# Altium schematic sheet 2-FET Control.SchDoc
size A
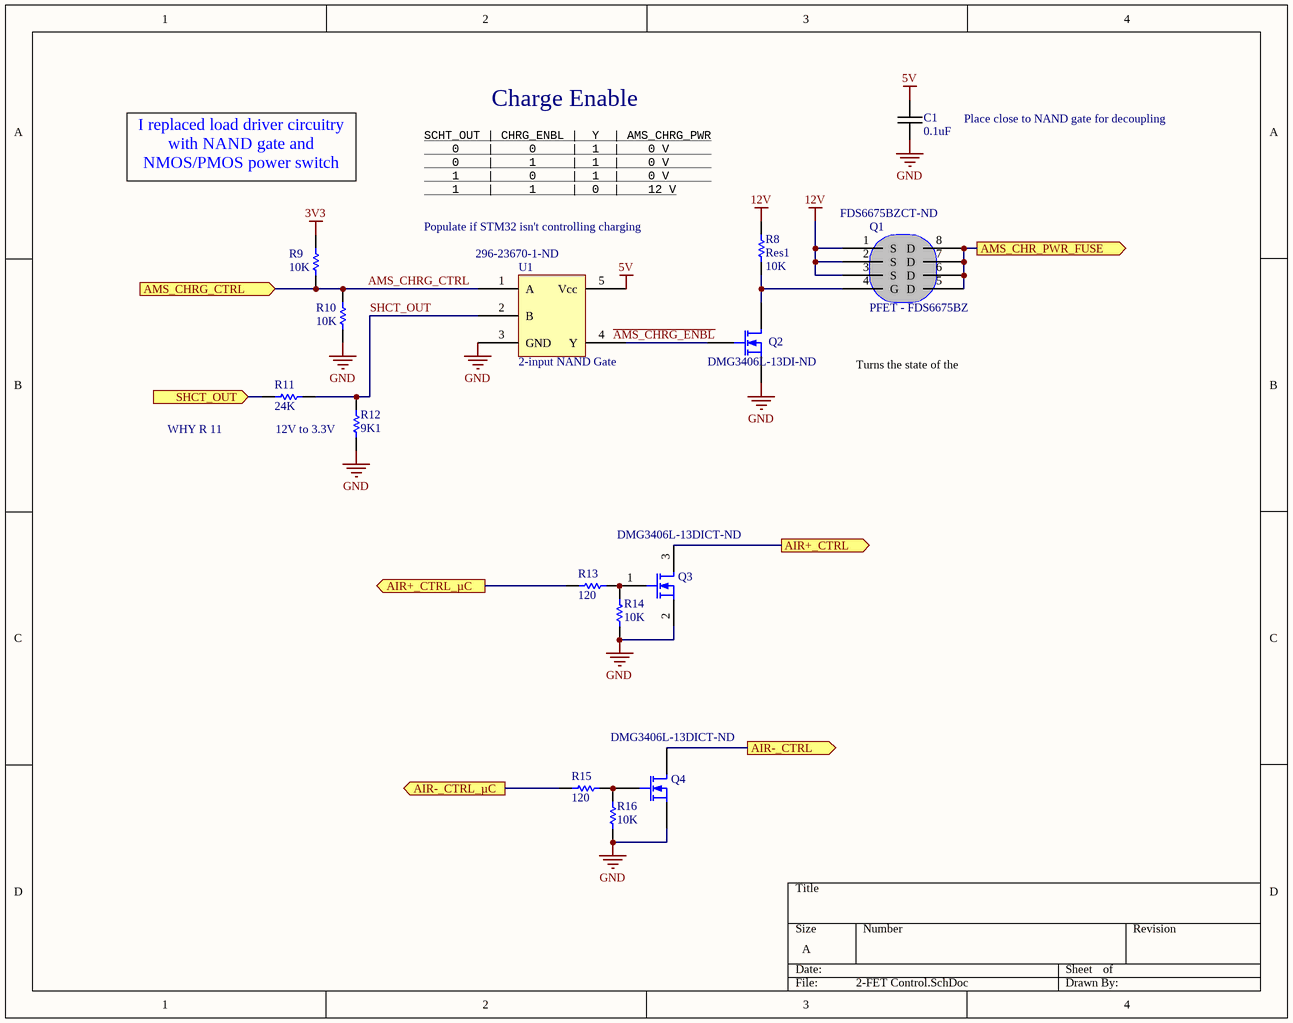
[diagram p0: 2-FET Control.SchDoc]

## Parts
C1  value 0.1uF  [1608[0603]]  (hidden comment: 100nF)
Q1  PFET - FDS6675BZ  Supplier Part Number 1: FDS6675BZCT-ND  [SOIC127P600X175-8N]
Q2  Supplier Part Number 1: DMG3406L-13DI-ND  [SOT-23_N]
Q3  Supplier Part Number 1: DMG3406L-13DICT-ND  [SOT-23_N]
Q4  Supplier Part Number 1: DMG3406L-13DICT-ND  [SOT-23_N]
R8  Res1  value 10K  [1608[0603]]
R9  10K  [RESC0603(1608)_L]
R10  10K  [RESC0603(1608)_L]
R11  24K  [RESC0603(1608)_N]
R12  9K1  [RESC0603(1608)_M]
R13  120  [1608[0603]]
R14  10K  [1608[0603]]
R15  120  [1608[0603]]
R16  10K  [1608[0603]]
U1  2-input NAND Gate  Supplier Part Number 1: 296-23670-1-ND  [SOT23-6_M]

## Ports
AIR+_CTRL (out), AIR+_CTRL_µC (out), AIR-_CTRL (out), AIR-_CTRL_µC (out), AMS_CHR_PWR_FUSE (out), AMS_CHRG_CTRL (in), SHCT_OUT (in)

## Nets
3V3: R9.2
5V: C1.1 U1.5(Vcc)
12V: Q1.1(S) Q1.2(S) Q1.3(S) R8.2
GND: C1.2 Q2.2(S) Q3.2(S) Q4.2(S) R10.1 R12.1 R14.1 R16.1 U1.3(GND)
AIR+_CTRL: Q3.3(D) ; port AIR+_CTRL
AIR+_CTRL_µC: R13.1 ; port AIR+_CTRL_µC
AIR-_CTRL: Q4.3(D) ; port AIR-_CTRL
AIR-_CTRL_µC: R15.1 ; port AIR-_CTRL_µC
AMS_CHR_PWR_FUSE: Q1.5(D) Q1.6(D) Q1.7(D) Q1.8(D) ; port AMS_CHR_PWR_FUSE
AMS_CHRG_CTRL: R9.1 R10.2 U1.1(A) ; port AMS_CHRG_CTRL
SHCT_OUT: R11.1 R12.2 U1.2(B)
SHCT_OUT: R11.2 ; port SHCT_OUT  [a separate net that carries the same name]
NetQ1_4: Q1.4(G) Q2.3(D) R8.1
NetQ2_1: Q2.1(G) U1.4(Y)
NetQ3_1: Q3.1(G) R13.2 R14.2
NetQ4_1: Q4.1(G) R15.2 R16.2

## Notes on the sheet
- Charge Enable
- Place close to NAND gate for decoupling
- I replaced load driver circuitry with NAND gate and NMOS/PMOS power switch
- (near R8) SCHT_OUT | CHRG_ENBL |  Y  | AMS_CHRG_PWR
  0    |     0     |  1  |    0 V
  0    |     1     |  1  |    0 V
  1    |     0     |  1  |    0 V
  1    |     1     |  0  |    12 V
- Populate if STM32 isn't controlling charging
- WHY R 11
- (near R12) 12V to 3.3V
- Turns the state of the
- Labels drawn without touching a wire or pin: ~{AMS_CHRG_ENBL}

## Library data of the parts
C1 = 0805C-100nF-25V-X7R-MUR: CAP CER 0.1UF 50V X7R 0603; Manufacturer: Kemet; Manufacturer Part Number: C0603C104K5RACAUTO; Capacitance: 0.1µF; Tolerance: ±10%; Supplier 1: Digi-Key; Supplier Part Number 1: 399-6856-1-ND; RoHS: RoHS Compliant; Category: Capacitors; Stock 1: 157876; Pricing 1: 1=0.14, 10=0.095, 25=0.0672, 50=0.0514, 100=0.0435, 250=0.03556, 1000=0.02324 (CAD); Packaging: Cut Tape (CT); Voltage - Rated: 50V; Temperature Coefficient: X7R; Mounting Type: Surface Mount, MLCC; Operating Temperature: -55°C ~ 125°C; Applications: Automotive; Ratings: AEC-Q200; Package / Case: 0603 (1608 Metric); Size / Dimension: 0.063" L x 0.031" W (1.60mm x 0.80mm); Height - Seated (Max): -; Thickness (Max): 0.034" (0.87mm); Lead Spacing: -; Features: -; Lead Style: -; ComponentLink1URL: http://capacitoredge.kemet.com/capedge2/DataSheet?pn=C0603C104K5RACAUTO; ComponentLink1Description: http://capacitoredge.kemet.com/capedge2/DataSheet?pn=C0603C104K5RACAUTO
Q1 = MOSFET: MOSFET P-CH 8-SOIC; Manufacturer: Fairchild/ON Semiconductor; FET Type: P-Channel; Drain to Source Voltage (Vdss): 30V; Current - Continuous Drain (Id) @ 25°C: 11A (Ta); Drive Voltage (Max Rds On,  Min Rds On): 4.5V, 10V; Vgs(th) (Max) @ Id: 3V @ 250µA; Gate Charge (Qg) (Max) @ Vgs: 62nC @ 10V; Input Capacitance (Ciss) (Max) @ Vds: 2470pF @ 15V; Vgs (Max): ±25V; Power Dissipation (Max): 2.5W (Ta); Rds On (Max) @ Id, Vgs: 13 mOhm @ 11A, 10V; Manufacturer Part Number: FDS6675BZ; RoHS: RoHS Compliant; Category: Discrete Semiconductor Products; Stock 1: 7940; Pricing 1: 1=1.29, 10=1.156, 100=0.9013, 500=0.74452, 1000=0.58778 (CAD); Packaging: Cut Tape (CT); Part Status: Active; Technology: MOSFET (Metal Oxide); FET Feature: -; Operating Temperature: -55°C ~ 150°C (TJ); Mounting Type: Surface Mount; Supplier Device Package: 8-SO; Package / Case: 8-SOIC (0.154", 3.90mm Width); ComponentLink1URL: https://www.fairchildsemi.com/datasheets/FD/FDS6675BZ.pdf; ComponentLink1Description: https://www.fairchildsemi.com/datasheets/FD/FDS6675BZ.pdf; Supplier 1: Digi-Key
Q2-Q4 = MOSFET-N: N-Channel MOSFET; Manufacturer: Infineon Technologies; Manufacturer Part Number: IPD075N03L G; FET Type: MOSFET N-Channel, Metal Oxide; FET Feature: Logic Level Gate; Drain to Source Voltage (Vdss): 30V; Current - Continuous Drain (Id) @ 25°C: 50A (Tc); Rds On (Max) @ Id, Vgs: 7.5 mOhm @ 30A, 10V; Vgs(th) (Max) @ Id: 2.2V @ 250µA; Gate Charge (Qg) @ Vgs: 18nC @ 10V; Input Capacitance (Ciss) @ Vds: 1900pF @ 15V; Power - Max: 47W; Published: 8-Jun-2000; LatestRevisionDate: 17-Jul-2002; LatestRevisionNote: Re-released for DXP Platform.; PackageVersion: 1995/1996; PackageReference: E3; Publisher: Altium Limited; PackageDescription: TO, Flat Index; 3 In-Line, Axial Leads; Body Dia. 4.6mm; Lead Dia. 0.5 mm (max); RoHS: RoHS Compliant; Category: Discrete Semiconductor Products; Packaging: Cut Tape (CT); Mounting Type: Surface Mount; Package / Case: TO-252-3, DPak (2 Leads + Tab), SC-63; Supplier Device Package: PG-TO252-3; ComponentLink1URL: http://www.infineon.com/dgdl/Infineon-IPD075N03LG-DS-v02_01-en.pdf?folderId=5546d4694909da4801490a07012f053b&fileId=db3a30431936bc4b011951d824f83aeb; ComponentLink1Description: http://www.infineon.com/dgdl/Infineon-IPD075N03LG-DS-v02_01-en.pdf?folderId=5546d4694909da4801490a07012f053b&fileId=db3a30431936bc4b011951d824f83aeb; ComponentLink2URL: http://www.semicon.toshiba.co.jp/info/docget.jsp?type=datasheet&lang=en&pid=SSM3K329R; ComponentLink2Description: http://www.semicon.toshiba.co.jp/info/docget.jsp?type=datasheet&lang=en&pid=SSM3K329R; Supplier 1: Digi-Key
R8 = Res1: RES SMD 10K OHM 5% 1/4W 0603; Manufacturer: Rohm Semiconductor; Manufacturer Part Number: ESR03EZPJ103; Power (Watts): 0.25W, 1/4W; Temperature Coefficient: ±200ppm/°C; Published: 8-Jun-2000; LatestRevisionDate: 17-Jul-2002; LatestRevisionNote: Re-released for DXP Platform.; PackageReference: AXIAL-0.3; Publisher: Altium Limited; PackageDescription: Axial Device, Thru-Hole; 2 Leads; 0.3 in Pin Spacing; Supplier 1: Digi-Key; Supplier Part Number 1: RHM10KDCT-ND; RoHS: RoHS Compliant; Category: Resistors; Stock 1: 0; Pricing 1: 1=0.15, 10=0.119, 25=0.0824, 50=0.0642, 100=0.0458, 250=0.03568, 500=0.02836, 1000=0.02012 (CAD); Packaging: Cut Tape (CT); Part Status: Active; Resistance (Ohms): 10k; Tolerance: ±5%; Composition: Thick Film; Features: Automotive AEC-Q200, Pulse Withstanding; Operating Temperature: -55°C ~ 155°C; Package / Case: 0603 (1608 Metric); Supplier Device Package: 0603; Size / Dimension: 0.063" L x 0.031" W (1.60mm x 0.80mm); Height - Seated (Max): 0.022" (0.55mm); Failure Rate: -; ComponentLink1URL: http://rohmfs.rohm.com/en/products/databook/datasheet/passive/resistor/chip_resistor/esr.pdf; ComponentLink1Description: http://rohmfs.rohm.com/en/products/databook/datasheet/passive/resistor/chip_resistor/esr.pdf
R9 R10 = CMP-1591-00001-1: 0603 (1608 Metric) Chip Resistor; Case-Metric: 1608; Case-EIA: 0603; PackageReference: RESC0603(1608); Supplier 1: Digi-Key; Supplier Part Number 1: 311-10KGRCT-ND
R11 = CMP-1012-00107-1: 24K 0.1W 5% 0603 (1608 Metric)  SMD; Case-Metric: 1608; Case-EIA: 0603; Value: 24000.00 Ohm; Tolerance: 5 %; Technology: SMT; Power: 0.1 W
R12 = CMP-1012-00097-1: 9K1 0.1W 5% 0603 (1608 Metric)  SMD; Case-EIA: 0603; Value: 9100.00 Ohm; Case-Metric: 1608; Technology: SMT; Power: 0.1 W; Tolerance: 5 %
R13 R15 = Res1: Resistor; Manufacturer: Panasonic Electronic Components; Manufacturer Part Number: ERJ-3EKF60R4V; Resistance (Ohms): 60.4; Tolerance: ±1%; Power (Watts): 0.1W, 1/10W; Temperature Coefficient: ±100ppm/°C; Published: 8-Jun-2000; LatestRevisionDate: 17-Jul-2002; LatestRevisionNote: Re-released for DXP Platform.; PackageReference: AXIAL-0.3; Publisher: Altium Limited; PackageDescription: Axial Device, Thru-Hole; 2 Leads; 0.3 in Pin Spacing; Value: 120; Supplier 1: Digi-Key; Supplier Part Number 1: P60.4HCT-ND; RoHS: RoHS Compliant; Category: Resistors; Stock 1: 113077; Pricing 1: 1=0.15, 50=0.0176, 100=0.0129, 250=0.00992, 500=0.0079, 1000=0.00583 (CAD); Packaging: Cut Tape (CT); Composition: Thick Film; Features: Automotive AEC-Q200; Operating Temperature: -55°C ~ 155°C; Package / Case: 0603 (1608 Metric); Supplier Device Package: 0603; Size / Dimension: 0.063" L x 0.031" W (1.60mm x 0.80mm); Height: 0.022" (0.55mm); Number of Terminations: 2; ComponentLink1URL: http://industrial.panasonic.com/www-cgi/jvcr13pz.cgi?E+PZ+3+AOA0002+ERJ3EKF60R4V+7+WW; ComponentLink1Description: http://industrial.panasonic.com/www-cgi/jvcr13pz.cgi?E+PZ+3+AOA0002+ERJ3EKF60R4V+7+WW
R14 R16 = Res1: Resistor; Manufacturer: Rohm Semiconductor; Manufacturer Part Number: ESR03EZPJ103; Tolerance: ±5%; Power (Watts): 0.25W, 1/4W; Temperature Coefficient: ±200ppm/°C; Published: 8-Jun-2000; LatestRevisionDate: 17-Jul-2002; LatestRevisionNote: Re-released for DXP Platform.; PackageReference: AXIAL-0.3; Publisher: Altium Limited; PackageDescription: Axial Device, Thru-Hole; 2 Leads; 0.3 in Pin Spacing; Value: 10K; Supplier 1: Digi-Key; Supplier Part Number 1: RHM10KDCT-ND; RoHS: RoHS Compliant; Category: Resistors; Stock 1: 8360; Pricing 1: 1=0.15, 10=0.121, 25=0.0836, 100=0.0466, 250=0.03628, 500=0.02884, 1000=0.02046 (CAD); Packaging: Cut Tape (CT); Resistance (Ohms): 10k; Composition: Thick Film; Features: Automotive AEC-Q200, Pulse Withstanding; Operating Temperature: -55°C ~ 155°C; Package / Case: 0603 (1608 Metric); Supplier Device Package: 0603 (1608 Metric); Size / Dimension: 0.063" L x 0.031" W (1.60mm x 0.80mm); Height: 0.022" (0.55mm); Number of Terminations: 2; ComponentLink1URL: http://rohmfs.rohm.com/en/products/databook/datasheet/passive/resistor/chip_resistor/esr.pdf; ComponentLink1Description: http://rohmfs.rohm.com/en/products/databook/datasheet/passive/resistor/chip_resistor/esr.pdf
U1 = NC7SZ08: IC GATE NAND 1CH 2-INP SC-70-5; Manufacturer: Texas Instruments; Manufacturer Part Number: SN74AHC1G00QDCKRQ1; Number of Circuits: 1; Number of Inputs: 2; Voltage - Supply: 2 V ~ 5.5 V; Current - Quiescent (Max): 1µA; Current - Output High, Low: 8mA, 8mA; Logic Level - Low: 0.5 V ~ 1.65 V; Logic Level - High: 1.5 V ~ 3.85 V; Max Propagation Delay @ V, Max CL: 7.5ns @ 5V, 50pF; RoHS: RoHS Compliant; Category: Integrated Circuits (ICs); Stock 1: 7211; Pricing 1: 1=0.69, 10=0.524, 100=0.3262, 500=0.22294, 1000=0.17137 (CAD); Packaging: Cut Tape (CT); Logic Type: NAND Gate; Features: Schmitt Trigger; Operating Temperature: -40°C ~ 125°C; Mounting Type: Surface Mount; Supplier Device Package: SC-70-5; Package / Case: 5-TSSOP, SC-70-5, SOT-353; ComponentLink1URL: http://www.ti.com/lit/ds/symlink/sn74ahc1g00-q1.pdf; ComponentLink1Description: http://www.ti.com/lit/ds/symlink/sn74ahc1g00-q1.pdf; Supplier 1: Digi-Key